# Altium schematic sheet microphone_array.SchDoc
size A4; SheetNumber: 1; SheetTotal: 1
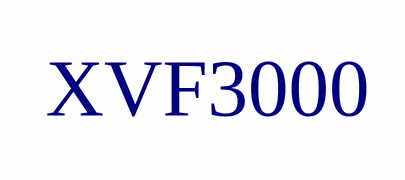
[diagram p0: microphone_array.SchDoc]

## Notes on the sheet
- XVF3000